# Altium schematic sheet fpga03-serdes-power.SchDoc
size Tabloid; SheetNumber: 45; SheetTotal: 71
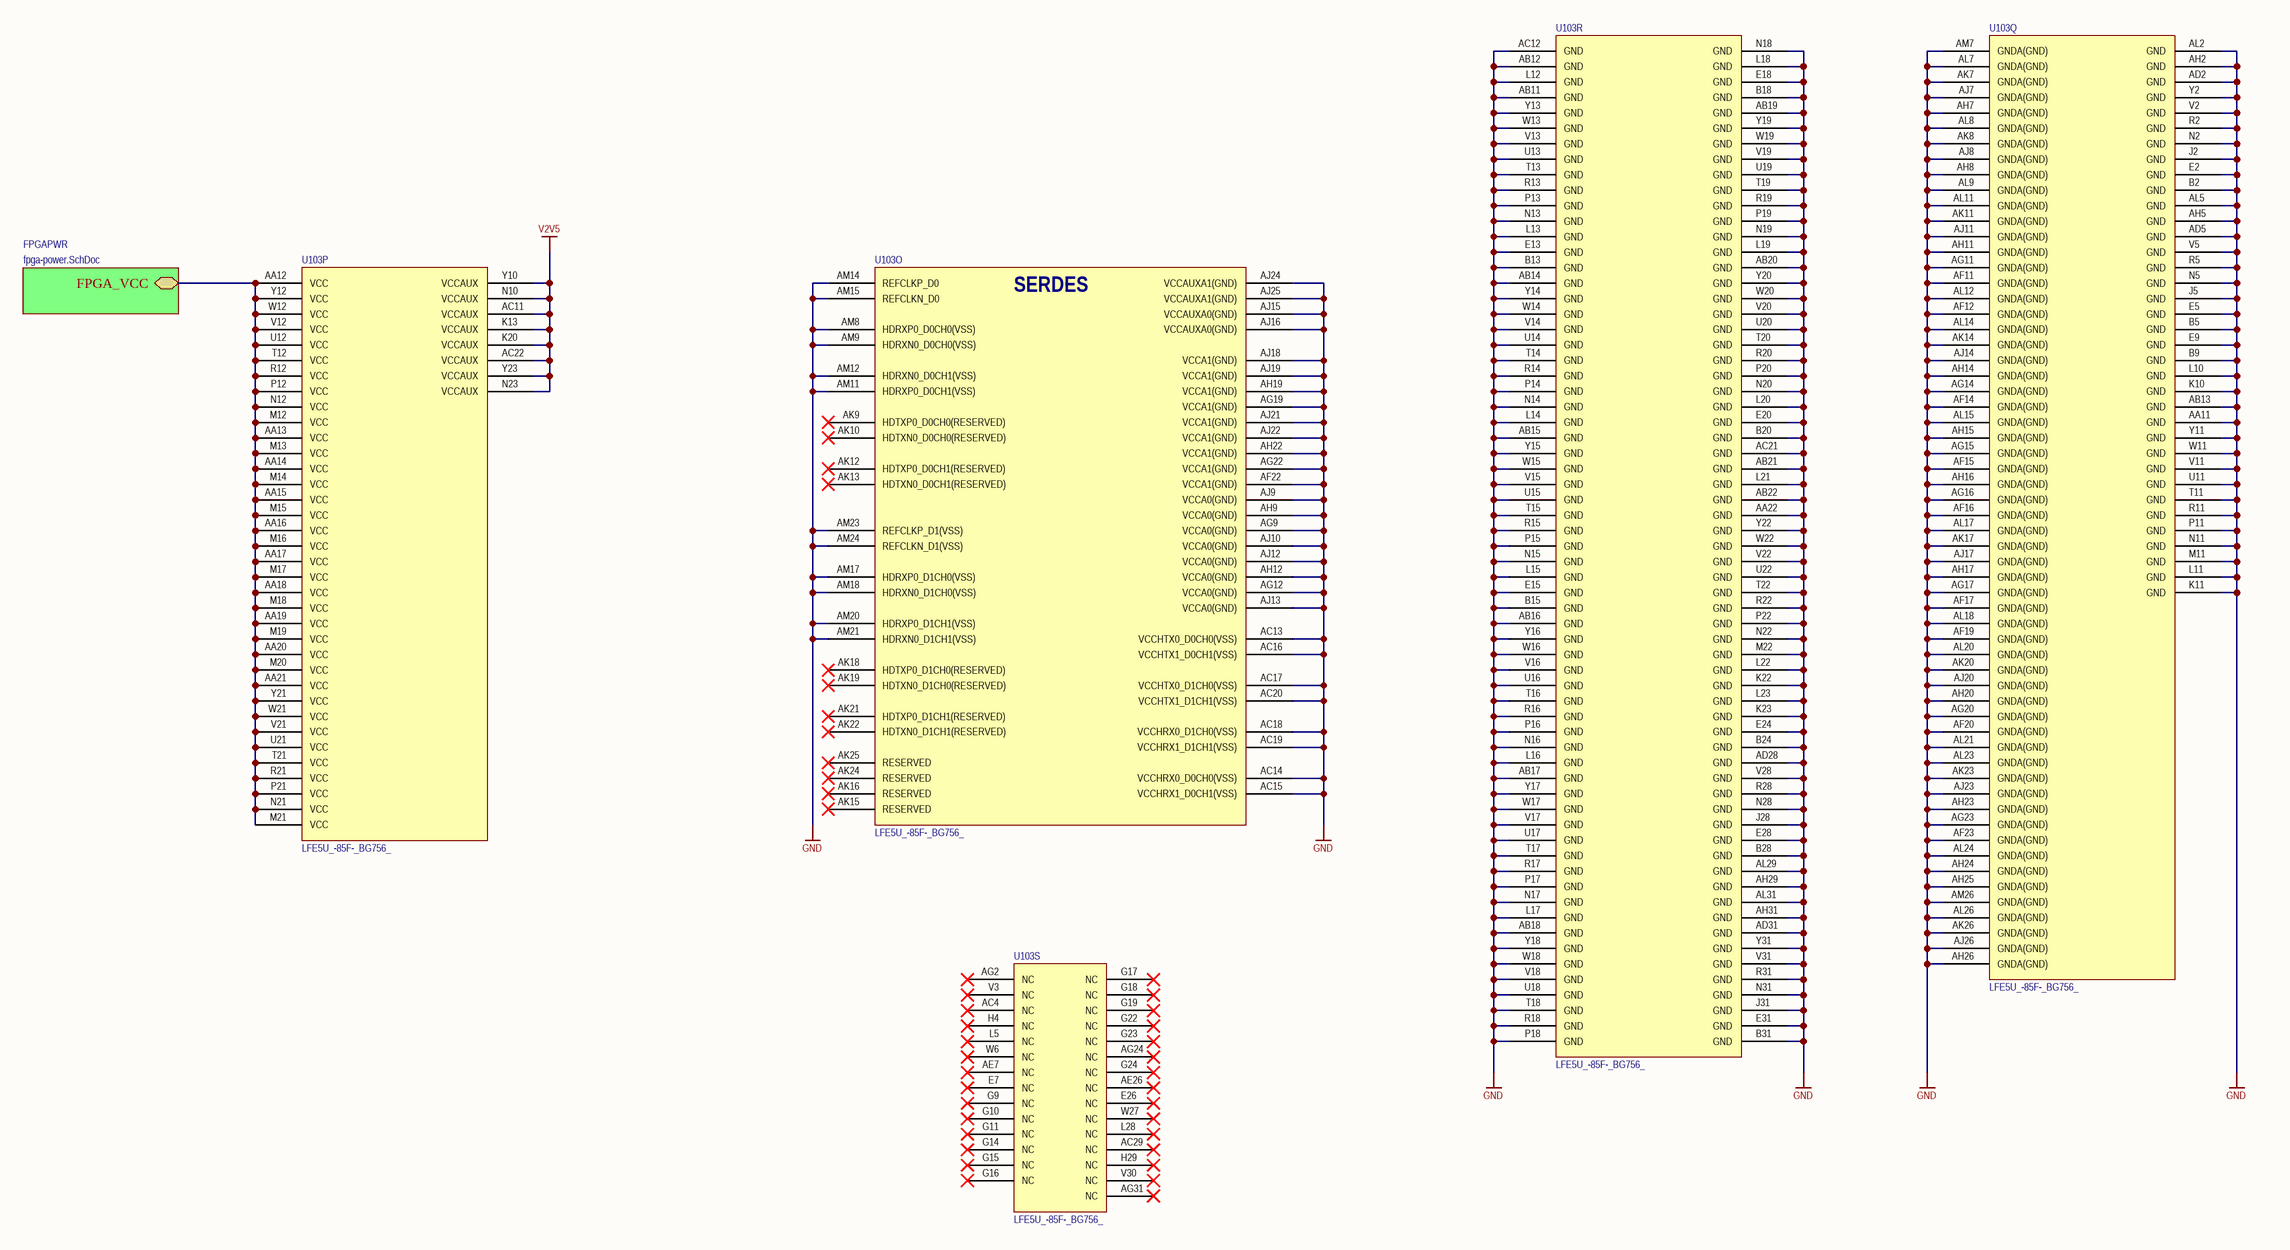
[diagram p0: fpga03-serdes-power.SchDoc]

## Parts
U103  LFE5U_-85F-_BG756_  [caBGA756]  (parts O,P,Q,R,S of 19)

## Sub-sheets
FPGAPWR = fpga-power.SchDoc: FPGA_VCC

## Nets
GND: U103.AA11(GND) U103.AA22(GND) U103.AB11(GND) U103.AB12(GND) U103.AB13(GND) U103.AB14(GND) U103.AB15(GND) U103.AB16(GND) U103.AB17(GND) U103.AB18(GND) U103.AB19(GND) U103.AB20(GND) U103.AB21(GND) U103.AB22(GND) U103.AC12(GND) U103.AC13(VCCHTX0_D0CH0(VSS)) U103.AC14(VCCHRX0_D0CH0(VSS)) U103.AC15(VCCHRX1_D0CH1(VSS)) U103.AC16(VCCHTX1_D0CH1(VSS)) U103.AC17(VCCHTX0_D1CH0(VSS)) U103.AC18(VCCHRX0_D1CH0(VSS)) U103.AC19(VCCHRX1_D1CH1(VSS)) U103.AC20(VCCHTX1_D1CH1(VSS)) U103.AC21(GND) U103.AD2(GND) U103.AD5(GND) U103.AD28(GND) U103.AD31(GND) U103.AF11(GNDA(GND)) U103.AF12(GNDA(GND)) U103.AF14(GNDA(GND)) U103.AF15(GNDA(GND)) U103.AF16(GNDA(GND)) U103.AF17(GNDA(GND)) U103.AF19(GNDA(GND)) U103.AF20(GNDA(GND)) U103.AF22(VCCA1(GND)) U103.AF23(GNDA(GND)) U103.AG9(VCCA0(GND)) U103.AG11(GNDA(GND)) U103.AG12(VCCA0(GND)) U103.AG14(GNDA(GND)) U103.AG15(GNDA(GND)) U103.AG16(GNDA(GND)) U103.AG17(GNDA(GND)) U103.AG19(VCCA1(GND)) U103.AG20(GNDA(GND)) U103.AG22(VCCA1(GND)) U103.AG23(GNDA(GND)) U103.AH2(GND) U103.AH5(GND) U103.AH7(GNDA(GND)) U103.AH8(GNDA(GND)) U103.AH9(VCCA0(GND)) U103.AH11(GNDA(GND)) U103.AH12(VCCA0(GND)) U103.AH14(GNDA(GND)) U103.AH15(GNDA(GND)) U103.AH16(GNDA(GND)) U103.AH17(GNDA(GND)) U103.AH19(VCCA1(GND)) U103.AH20(GNDA(GND)) U103.AH22(VCCA1(GND)) U103.AH23(GNDA(GND)) U103.AH24(GNDA(GND)) U103.AH25(GNDA(GND)) U103.AH26(GNDA(GND)) U103.AH29(GND) U103.AH31(GND) U103.AJ7(GNDA(GND)) U103.AJ8(GNDA(GND)) U103.AJ9(VCCA0(GND)) U103.AJ10(VCCA0(GND)) U103.AJ11(GNDA(GND)) U103.AJ12(VCCA0(GND)) U103.AJ13(VCCA0(GND)) U103.AJ14(GNDA(GND)) U103.AJ15(VCCAUXA0(GND)) U103.AJ16(VCCAUXA0(GND)) U103.AJ17(GNDA(GND)) U103.AJ18(VCCA1(GND)) U103.AJ19(VCCA1(GND)) U103.AJ20(GNDA(GND)) U103.AJ21(VCCA1(GND)) U103.AJ22(VCCA1(GND)) U103.AJ23(GNDA(GND)) U103.AJ24(VCCAUXA1(GND)) U103.AJ25(VCCAUXA1(GND)) U103.AJ26(GNDA(GND)) U103.AK7(GNDA(GND)) U103.AK8(GNDA(GND)) U103.AK11(GNDA(GND)) U103.AK14(GNDA(GND)) U103.AK17(GNDA(GND)) U103.AK20(GNDA(GND)) U103.AK23(GNDA(GND)) U103.AK26(GNDA(GND)) U103.AL2(GND) U103.AL5(GND) U103.AL7(GNDA(GND)) U103.AL8(GNDA(GND)) U103.AL9(GNDA(GND)) U103.AL11(GNDA(GND)) U103.AL12(GNDA(GND)) U103.AL14(GNDA(GND)) U103.AL15(GNDA(GND)) U103.AL17(GNDA(GND)) U103.AL18(GNDA(GND)) U103.AL20(GNDA(GND)) U103.AL21(GNDA(GND)) U103.AL23(GNDA(GND)) U103.AL24(GNDA(GND)) U103.AL26(GNDA(GND)) U103.AL29(GND) U103.AL31(GND) U103.AM7(GNDA(GND)) U103.AM8(HDRXP0_D0CH0(VSS)) U103.AM9(HDRXN0_D0CH0(VSS)) U103.AM11(HDRXP0_D0CH1(VSS)) U103.AM12(HDRXN0_D0CH1(VSS)) U103.AM14(REFCLKP_D0) U103.AM15(REFCLKN_D0) U103.AM17(HDRXP0_D1CH0(VSS)) U103.AM18(HDRXN0_D1CH0(VSS)) U103.AM20(HDRXP0_D1CH1(VSS)) U103.AM21(HDRXN0_D1CH1(VSS)) U103.AM23(REFCLKP_D1(VSS)) U103.AM24(REFCLKN_D1(VSS)) U103.AM26(GNDA(GND)) U103.B2(GND) U103.B5(GND) U103.B9(GND) U103.B13(GND) U103.B15(GND) U103.B18(GND) U103.B20(GND) U103.B24(GND) U103.B28(GND) U103.B31(GND) U103.E2(GND) U103.E5(GND) U103.E9(GND) U103.E13(GND) U103.E15(GND) U103.E18(GND) U103.E20(GND) U103.E24(GND) U103.E28(GND) U103.E31(GND) U103.J2(GND) U103.J5(GND) U103.J28(GND) U103.J31(GND) U103.K10(GND) U103.K11(GND) U103.K22(GND) U103.K23(GND) U103.L10(GND) U103.L11(GND) U103.L12(GND) U103.L13(GND) U103.L14(GND) U103.L15(GND) U103.L16(GND) U103.L17(GND) U103.L18(GND) U103.L19(GND) U103.L20(GND) U103.L21(GND) U103.L22(GND) U103.L23(GND) U103.M11(GND) U103.M22(GND) U103.N2(GND) U103.N5(GND) U103.N11(GND) U103.N13(GND) U103.N14(GND) U103.N15(GND) U103.N16(GND) U103.N17(GND) U103.N18(GND) U103.N19(GND) U103.N20(GND) U103.N22(GND) U103.N28(GND) U103.N31(GND) U103.P11(GND) U103.P13(GND) U103.P14(GND) U103.P15(GND) U103.P16(GND) U103.P17(GND) U103.P18(GND) U103.P19(GND) U103.P20(GND) U103.P22(GND) U103.R2(GND) U103.R5(GND) U103.R11(GND) U103.R13(GND) U103.R14(GND) U103.R15(GND) U103.R16(GND) U103.R17(GND) U103.R18(GND) U103.R19(GND) U103.R20(GND) U103.R22(GND) U103.R28(GND) U103.R31(GND) U103.T11(GND) U103.T13(GND) U103.T14(GND) U103.T15(GND) U103.T16(GND) U103.T17(GND) U103.T18(GND) U103.T19(GND) U103.T20(GND) U103.T22(GND) U103.U11(GND) U103.U13(GND) U103.U14(GND) U103.U15(GND) U103.U16(GND) U103.U17(GND) U103.U18(GND) U103.U19(GND) U103.U20(GND) U103.U22(GND) U103.V2(GND) U103.V5(GND) U103.V11(GND) U103.V13(GND) U103.V14(GND) U103.V15(GND) U103.V16(GND) U103.V17(GND) U103.V18(GND) U103.V19(GND) U103.V20(GND) U103.V22(GND) U103.V28(GND) U103.V31(GND) U103.W11(GND) U103.W13(GND) U103.W14(GND) U103.W15(GND) U103.W16(GND) U103.W17(GND) U103.W18(GND) U103.W19(GND) U103.W20(GND) U103.W22(GND) U103.Y2(GND) U103.Y11(GND) U103.Y13(GND) U103.Y14(GND) U103.Y15(GND) U103.Y16(GND) U103.Y17(GND) U103.Y18(GND) U103.Y19(GND) U103.Y20(GND) U103.Y22(GND) U103.Y31(GND)
V2V5: U103.AC11(VCCAUX) U103.AC22(VCCAUX) U103.K13(VCCAUX) U103.K20(VCCAUX) U103.N10(VCCAUX) U103.N23(VCCAUX) U103.Y10(VCCAUX) U103.Y23(VCCAUX)
NetU103_AA12: U103.AA12(VCC) U103.AA13(VCC) U103.AA14(VCC) U103.AA15(VCC) U103.AA16(VCC) U103.AA17(VCC) U103.AA18(VCC) U103.AA19(VCC) U103.AA20(VCC) U103.AA21(VCC) U103.M12(VCC) U103.M13(VCC) U103.M14(VCC) U103.M15(VCC) U103.M16(VCC) U103.M17(VCC) U103.M18(VCC) U103.M19(VCC) U103.M20(VCC) U103.M21(VCC) U103.N12(VCC) U103.N21(VCC) U103.P12(VCC) U103.P21(VCC) U103.R12(VCC) U103.R21(VCC) U103.T12(VCC) U103.T21(VCC) U103.U12(VCC) U103.U21(VCC) U103.V12(VCC) U103.V21(VCC) U103.W12(VCC) U103.W21(VCC) U103.Y12(VCC) U103.Y21(VCC) ; sheet FPGAPWR/FPGA_VCC

Not connected (* = marked no-connect by the designer): U103 AC4(NC)* AC29(NC)* AE7(NC)* AE26(NC)* AG2(NC)* AG24(NC)* AG31(NC)* AK9(HDTXP0_D0CH0(RESERVED))* AK10(HDTXN0_D0CH0(RESERVED))* AK12(HDTXP0_D0CH1(RESERVED))* AK13(HDTXN0_D0CH1(RESERVED))* AK15(RESERVED)* AK16(RESERVED)* AK18(HDTXP0_D1CH0(RESERVED))* AK19(HDTXN0_D1CH0(RESERVED))* AK21(HDTXP0_D1CH1(RESERVED))* AK22(HDTXN0_D1CH1(RESERVED))* AK24(RESERVED)* AK25(RESERVED)* E7(NC)* E26(NC)* G9(NC)* G10(NC)* G11(NC)* G14(NC)* G15(NC)* G16(NC)* G17(NC)* G18(NC)* G19(NC)* G22(NC)* G23(NC)* G24(NC)* H4(NC)* H29(NC)* L5(NC)* L28(NC)* V3(NC)* V30(NC)* W6(NC)* W27(NC)*

## Notes on the sheet
- (in symbol LFE5U_-85F-_BG756_, part O) SERDES

## Library data of the parts
U103 = LFE5U_-85F-_BG756_: ECP5 FPGA, 85k LUT, 756-caBGA; Manufacturer: Lattice Semiconductor; Manufacturer P/N: LFE5U_-85F-_BG756_